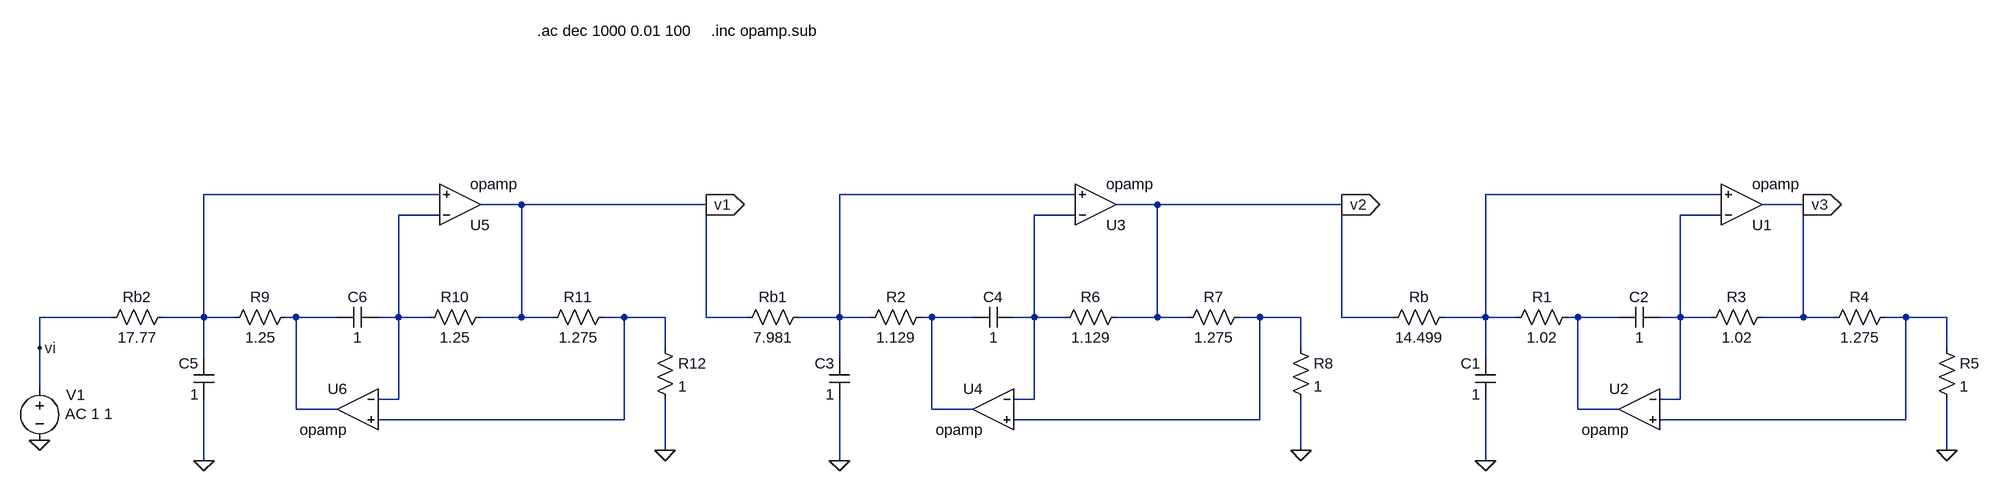
[diagram p0: schematic GIC bandpass.ASC.asc]
GIC bandpass.ASC.asc, the LTspice schematic file:
Version 4
SHEET 1 1960 680
WIRE -448 64 -816 64
WIRE 544 64 176 64
WIRE 1552 64 1184 64
WIRE -320 80 -384 80
WIRE -32 80 -320 80
WIRE 672 80 608 80
WIRE 960 80 672 80
WIRE 1680 80 1616 80
WIRE -448 96 -512 96
WIRE 544 96 480 96
WIRE 1552 96 1488 96
WIRE -960 256 -1072 256
WIRE -816 256 -816 64
WIRE -816 256 -880 256
WIRE -768 256 -816 256
WIRE -672 256 -688 256
WIRE -608 256 -672 256
WIRE -512 256 -512 96
WIRE -512 256 -544 256
WIRE -464 256 -512 256
WIRE -320 256 -320 80
WIRE -320 256 -384 256
WIRE -272 256 -320 256
WIRE -160 256 -192 256
WIRE -96 256 -160 256
WIRE -32 256 -32 80
WIRE 32 256 -32 256
WIRE 176 256 176 64
WIRE 176 256 112 256
WIRE 224 256 176 256
WIRE 320 256 304 256
WIRE 384 256 320 256
WIRE 480 256 480 96
WIRE 480 256 448 256
WIRE 528 256 480 256
WIRE 672 256 672 80
WIRE 672 256 608 256
WIRE 720 256 672 256
WIRE 832 256 800 256
WIRE 896 256 832 256
WIRE 960 256 960 80
WIRE 1040 256 960 256
WIRE 1184 256 1184 64
WIRE 1184 256 1120 256
WIRE 1232 256 1184 256
WIRE 1328 256 1312 256
WIRE 1392 256 1328 256
WIRE 1488 256 1488 96
WIRE 1488 256 1456 256
WIRE 1536 256 1488 256
WIRE 1680 256 1680 80
WIRE 1680 256 1616 256
WIRE 1728 256 1680 256
WIRE 1840 256 1808 256
WIRE 1904 256 1840 256
WIRE -1072 304 -1072 256
WIRE -96 304 -96 256
WIRE 896 304 896 256
WIRE 1904 304 1904 256
WIRE -816 320 -816 256
WIRE 176 320 176 256
WIRE 1184 320 1184 256
WIRE -1072 368 -1072 304
WIRE -512 384 -512 256
WIRE -512 384 -544 384
WIRE 480 384 480 256
WIRE 480 384 448 384
WIRE 1488 384 1488 256
WIRE 1488 384 1456 384
WIRE -672 400 -672 256
WIRE -608 400 -672 400
WIRE 320 400 320 256
WIRE 384 400 320 400
WIRE 1328 400 1328 256
WIRE 1392 400 1328 400
WIRE -160 416 -160 256
WIRE -160 416 -544 416
WIRE 832 416 832 256
WIRE 832 416 448 416
WIRE 1840 416 1840 256
WIRE 1840 416 1456 416
WIRE -96 464 -96 384
WIRE 896 464 896 384
WIRE 1904 464 1904 384
WIRE -816 480 -816 384
WIRE 176 480 176 384
WIRE 1184 480 1184 384
FLAG 1904 464 0
FLAG 1184 480 0
FLAG -1072 448 0
FLAG -1072 304 vi
FLAG 896 464 0
FLAG 176 480 0
FLAG -96 464 0
FLAG -816 480 0
FLAG -32 80 v1
IOPIN -32 80 Out
FLAG 960 80 v2
IOPIN 960 80 Out
FLAG 1680 80 v3
IOPIN 1680 80 Out
SYMBOL res 1136 240 R90
WINDOW 0 0 56 VBottom 2
WINDOW 3 32 56 VTop 2
SYMATTR InstName Rb
SYMATTR Value 14.499
SYMBOL res 1216 272 R270
WINDOW 0 32 56 VTop 2
WINDOW 3 0 56 VBottom 2
SYMATTR InstName R1
SYMATTR Value 1.02
SYMBOL res 1520 272 R270
WINDOW 0 32 56 VTop 2
WINDOW 3 0 56 VBottom 2
SYMATTR InstName R3
SYMATTR Value 1.02
SYMBOL res 1712 272 R270
WINDOW 0 32 56 VTop 2
WINDOW 3 0 56 VBottom 2
SYMATTR InstName R4
SYMATTR Value 1.275
SYMBOL res 1888 288 R0
SYMATTR InstName R5
SYMATTR Value 1
SYMBOL cap 1200 384 R180
WINDOW 0 24 56 Left 2
WINDOW 3 24 8 Left 2
SYMATTR InstName C1
SYMATTR Value 1
SYMBOL cap 1392 272 R270
WINDOW 0 32 32 VTop 2
WINDOW 3 0 32 VBottom 2
SYMATTR InstName C2
SYMATTR Value 1
SYMBOL OpAmps\\opamp 1584 144 M180
SYMATTR InstName U1
SYMBOL OpAmps\\opamp 1424 336 M0
SYMATTR InstName U2
SYMBOL voltage -1072 352 R0
WINDOW 123 40 55 Left 2
WINDOW 39 0 0 Left 0
WINDOW 0 41 25 Left 2
SYMATTR Value2 AC 1 1
SYMATTR InstName V1
SYMATTR Value ""
SYMBOL res 128 240 R90
WINDOW 0 0 56 VBottom 2
WINDOW 3 32 56 VTop 2
SYMATTR InstName Rb1
SYMATTR Value 7.981
SYMBOL res 208 272 R270
WINDOW 0 32 56 VTop 2
WINDOW 3 0 56 VBottom 2
SYMATTR InstName R2
SYMATTR Value 1.129
SYMBOL res 512 272 R270
WINDOW 0 32 56 VTop 2
WINDOW 3 0 56 VBottom 2
SYMATTR InstName R6
SYMATTR Value 1.129
SYMBOL res 704 272 R270
WINDOW 0 32 56 VTop 2
WINDOW 3 0 56 VBottom 2
SYMATTR InstName R7
SYMATTR Value 1.275
SYMBOL res 880 288 R0
SYMATTR InstName R8
SYMATTR Value 1
SYMBOL cap 192 384 R180
WINDOW 0 24 56 Left 2
WINDOW 3 24 8 Left 2
SYMATTR InstName C3
SYMATTR Value 1
SYMBOL cap 384 272 R270
WINDOW 0 32 32 VTop 2
WINDOW 3 0 32 VBottom 2
SYMATTR InstName C4
SYMATTR Value 1
SYMBOL OpAmps\\opamp 576 144 M180
SYMATTR InstName U3
SYMBOL OpAmps\\opamp 416 336 M0
SYMATTR InstName U4
SYMBOL res -864 240 R90
WINDOW 0 0 56 VBottom 2
WINDOW 3 32 56 VTop 2
SYMATTR InstName Rb2
SYMATTR Value 17.77
SYMBOL res -784 272 R270
WINDOW 0 32 56 VTop 2
WINDOW 3 0 56 VBottom 2
SYMATTR InstName R9
SYMATTR Value 1.25
SYMBOL res -480 272 R270
WINDOW 0 32 56 VTop 2
WINDOW 3 0 56 VBottom 2
SYMATTR InstName R10
SYMATTR Value 1.25
SYMBOL res -288 272 R270
WINDOW 0 32 56 VTop 2
WINDOW 3 0 56 VBottom 2
SYMATTR InstName R11
SYMATTR Value 1.275
SYMBOL res -112 288 R0
SYMATTR InstName R12
SYMATTR Value 1
SYMBOL cap -800 384 R180
WINDOW 0 24 56 Left 2
WINDOW 3 24 8 Left 2
SYMATTR InstName C5
SYMATTR Value 1
SYMBOL cap -608 272 R270
WINDOW 0 32 32 VTop 2
WINDOW 3 0 32 VBottom 2
SYMATTR InstName C6
SYMATTR Value 1
SYMBOL OpAmps\\opamp -416 144 M180
SYMATTR InstName U5
SYMBOL OpAmps\\opamp -576 336 M0
SYMATTR InstName U6
TEXT -296 -192 Left 2 !.ac dec 1000 0.01 100
TEXT -24 -192 Left 2 !.inc opamp.sub

The netlist it stands for:
* GIC bandpass.ASC.asc
Rb N003 v2 14.499
R1 N003 N011 1.02
R3 N006 v3 1.02
R4 v3 N012 1.275
R5 N012 0 1
C1 0 N003 1
C2 N011 N006 1
XU1 N006 N003 v3 opamp Aol=100K GBW=10Meg  ; pins invin noninvin out
XU2 N006 N012 N011 opamp Aol=100K GBW=10Meg  ; pins invin noninvin out
V1 vi 0 AC 1 1
Rb1 N002 v1 7.981
R2 N002 N009 1.129
R6 N005 v2 1.129
R7 v2 N010 1.275
R8 N010 0 1
C3 0 N002 1
C4 N009 N005 1
XU3 N005 N002 v2 opamp Aol=100K GBW=10Meg  ; pins invin noninvin out
XU4 N005 N010 N009 opamp Aol=100K GBW=10Meg  ; pins invin noninvin out
Rb2 N001 vi 17.77
R9 N001 N007 1.25
R10 N004 v1 1.25
R11 v1 N008 1.275
R12 N008 0 1
C5 0 N001 1
C6 N007 N004 1
XU5 N004 N001 v1 opamp Aol=100K GBW=10Meg  ; pins invin noninvin out
XU6 N004 N008 N007 opamp Aol=100K GBW=10Meg  ; pins invin noninvin out
.ac dec 1000 0.01 100
.inc opamp.sub
.backanno
.end